# EAGLE design Multi_FPC_BreakOut (EAGLE 5.11)
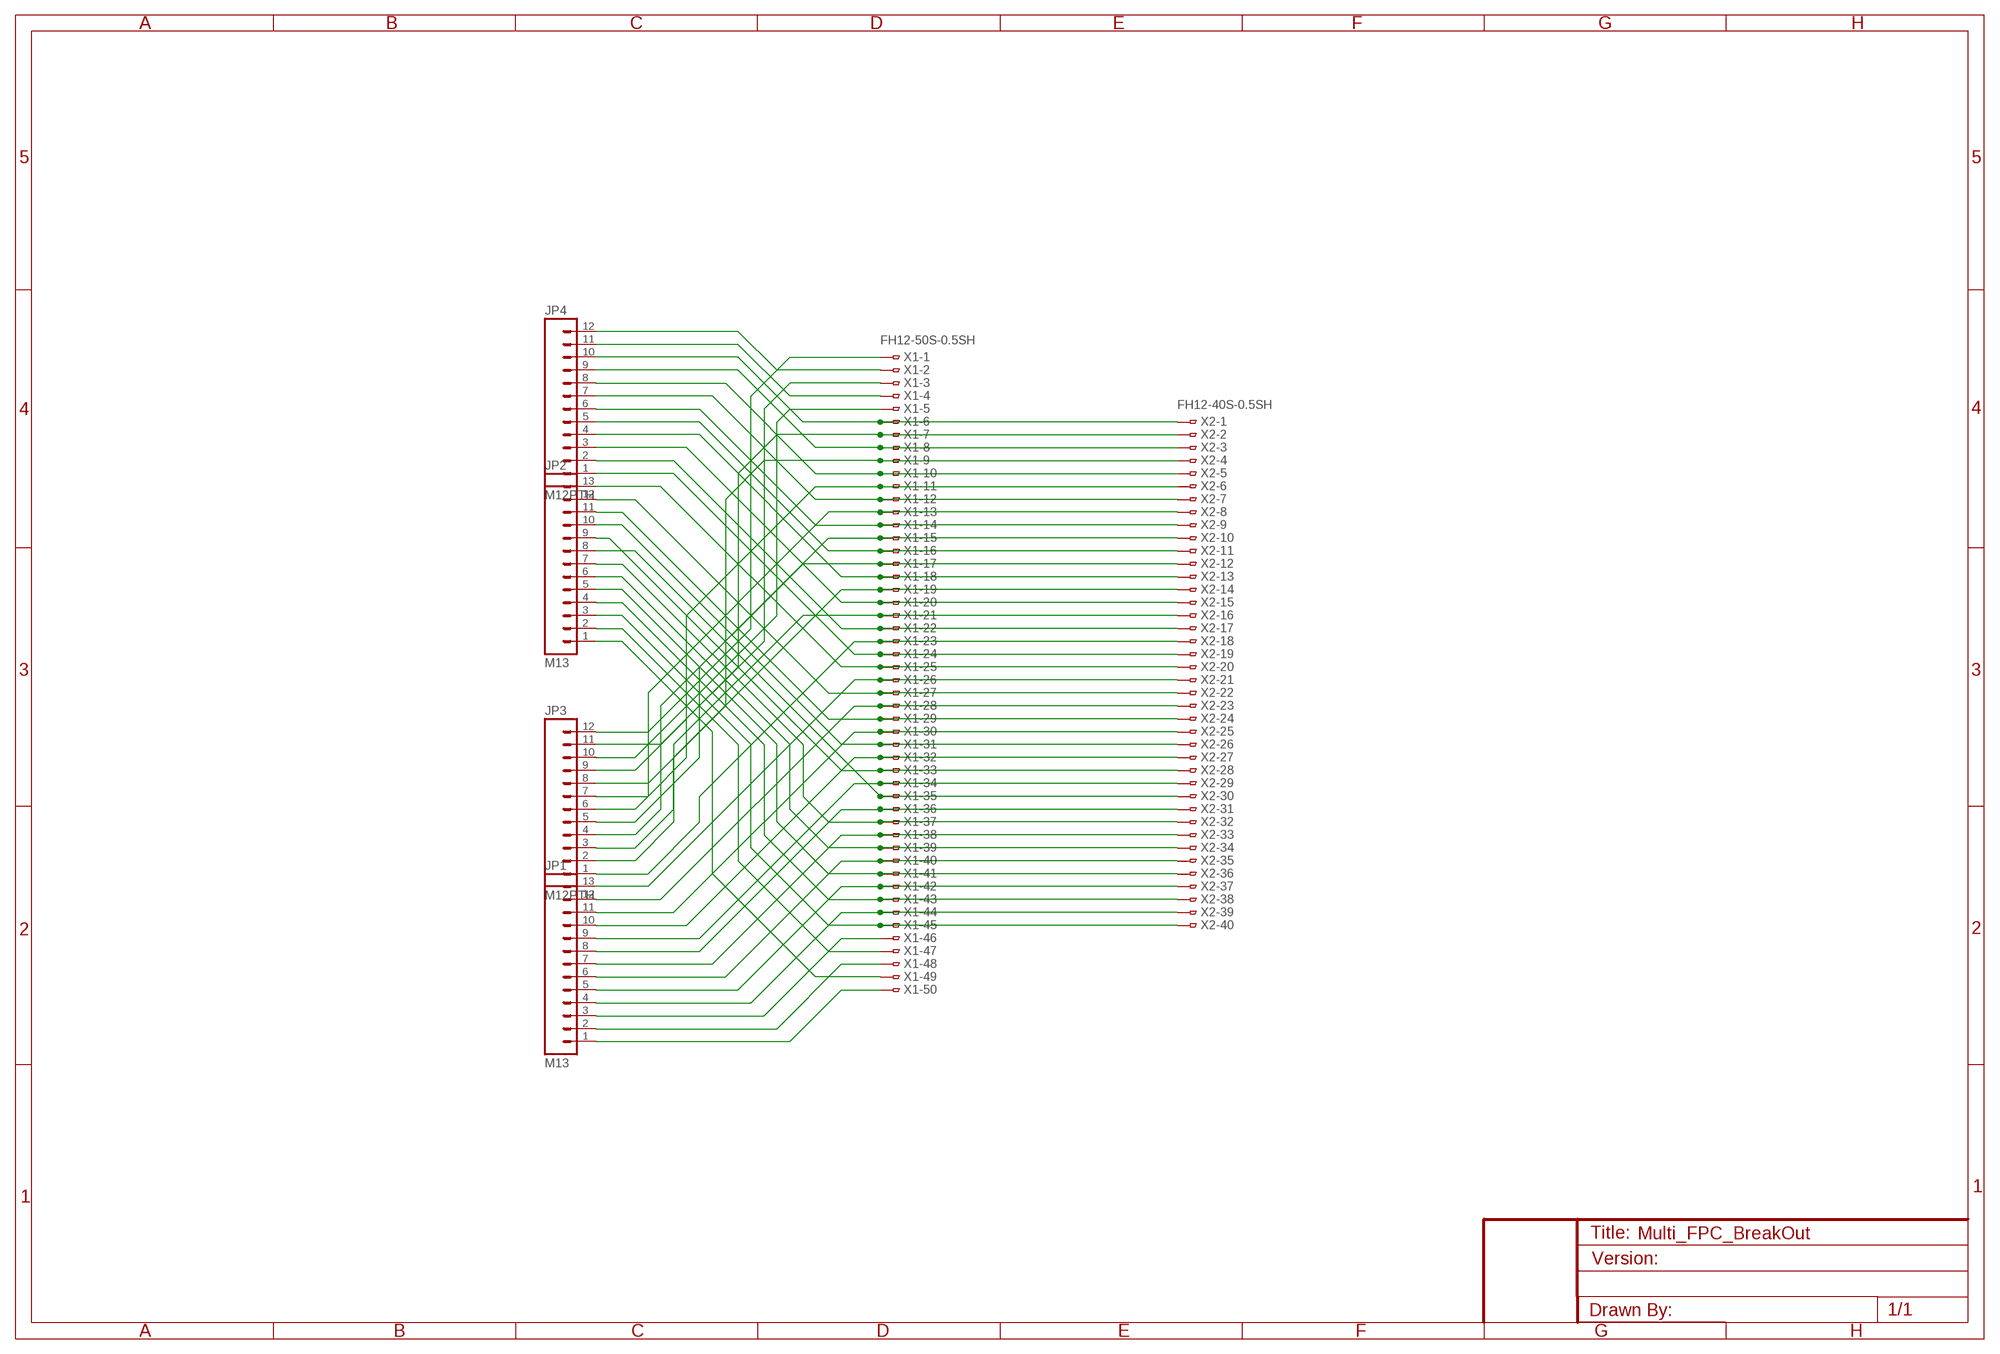
[diagram p0: schematic, sheet 1]

## Parts
JP1  M13  [1X13]
JP2  M13  [1X13]
JP3  M12PTH  [1X12]
JP4  M12PTH  [1X12]
X1  FH12-50S-0.5SH  [FH12-50S-0.5SH]
X2  FH12-40S-0.5SH  [FH12-40S-0.5SH]

## Nets
N$1: JP3.12 X1.1
N$2: JP4.12 X1.2
N$3: JP3.11 X1.3
N$4: JP3.10 X1.5
N$5: JP4.11 X1.4
N$7: JP3.9 X1.7 X2.2
N$9: JP3.8 X1.9 X2.4
N$11: JP3.7 X1.11 X2.6
N$13: JP3.6 X1.13 X2.8
N$15: JP3.5 X1.15 X2.10
N$17: JP3.4 X1.17 X2.12
N$19: JP3.3 X1.19 X2.14
N$20: JP4.3 X1.20 X2.15
N$21: JP3.2 X1.21 X2.16
N$22: JP4.2 X1.22 X2.17
N$23: JP3.1 X1.23 X2.18
N$24: JP4.1 X1.24 X2.19
N$25: JP2.13 X1.25 X2.20
N$26: JP1.13 X1.26 X2.21
N$27: JP2.12 X1.27 X2.22
N$28: JP1.12 X1.28 X2.23
N$29: JP2.11 X1.29 X2.24
N$30: JP1.11 X1.30 X2.25
N$31: JP2.10 X1.31 X2.26
N$32: JP1.10 X1.32 X2.27
N$33: JP2.9 X1.33 X2.28
N$34: JP1.9 X1.34 X2.29
N$35: JP2.8 X1.35 X2.30
N$36: JP1.8 X1.36 X2.31
N$37: JP2.7 X1.37 X2.32
N$38: JP1.7 X1.38 X2.33
N$39: JP2.6 X1.39 X2.34
N$40: JP1.6 X1.40 X2.35
N$41: JP2.5 X1.41 X2.36
N$42: JP1.5 X1.42 X2.37
N$43: JP2.4 X1.43 X2.38
N$44: JP1.4 X1.44 X2.39
N$45: JP2.3 X1.45 X2.40
N$46: JP4.10 X1.6 X2.1
N$47: JP2.2 X1.47
N$48: JP2.1 X1.49
N$50: JP4.9 X1.8 X2.3
N$52: JP4.8 X1.10 X2.5
N$54: JP4.7 X1.12 X2.7
N$56: JP4.6 X1.14 X2.9
N$57: JP1.3 X1.46
N$58: JP1.2 X1.48
N$59: JP1.1 X1.50
N$61: JP4.5 X1.16 X2.11
N$63: JP4.4 X1.18 X2.13

## Library data of the parts
JP1 JP2 = SparkFun:M13
JP3 JP4 = SparkFun:M12: Header 12 Standard 12-pin 0.1" header. Use with straight break away headers (SKU : PRT-00116), right angle break away headers (PRT-00553), swiss pins (PRT-00743), machine pins (PRT-00117), and female headers (PRT-00115).
X1 = con-hirose:FH12-50S-0.5S: 0.5mm Pitch Connectors For FPC/FFC Source: Data sheet <http://www.hirose.co.jp/cataloge_hp/e58605370.pdf>; MPN: FH12-50S-0.5SH(55); OC_FARNELL: 1324557; OC_NEWARK: 34M6181
X2 = con-hirose:FH12-40S-0.5S: 0.5mm Pitch Connectors For FPC/FFC Source: Data sheet <http://www.hirose.co.jp/cataloge_hp/e58605370.pdf>; MPN: FH12-40S-0.5SH(55); OC_FARNELL: 1324556; OC_NEWARK: 34M6178

## Net classes
0 default: width 0.178 mm, drill 0.178 mm, clearance 0.178 mm

## Board
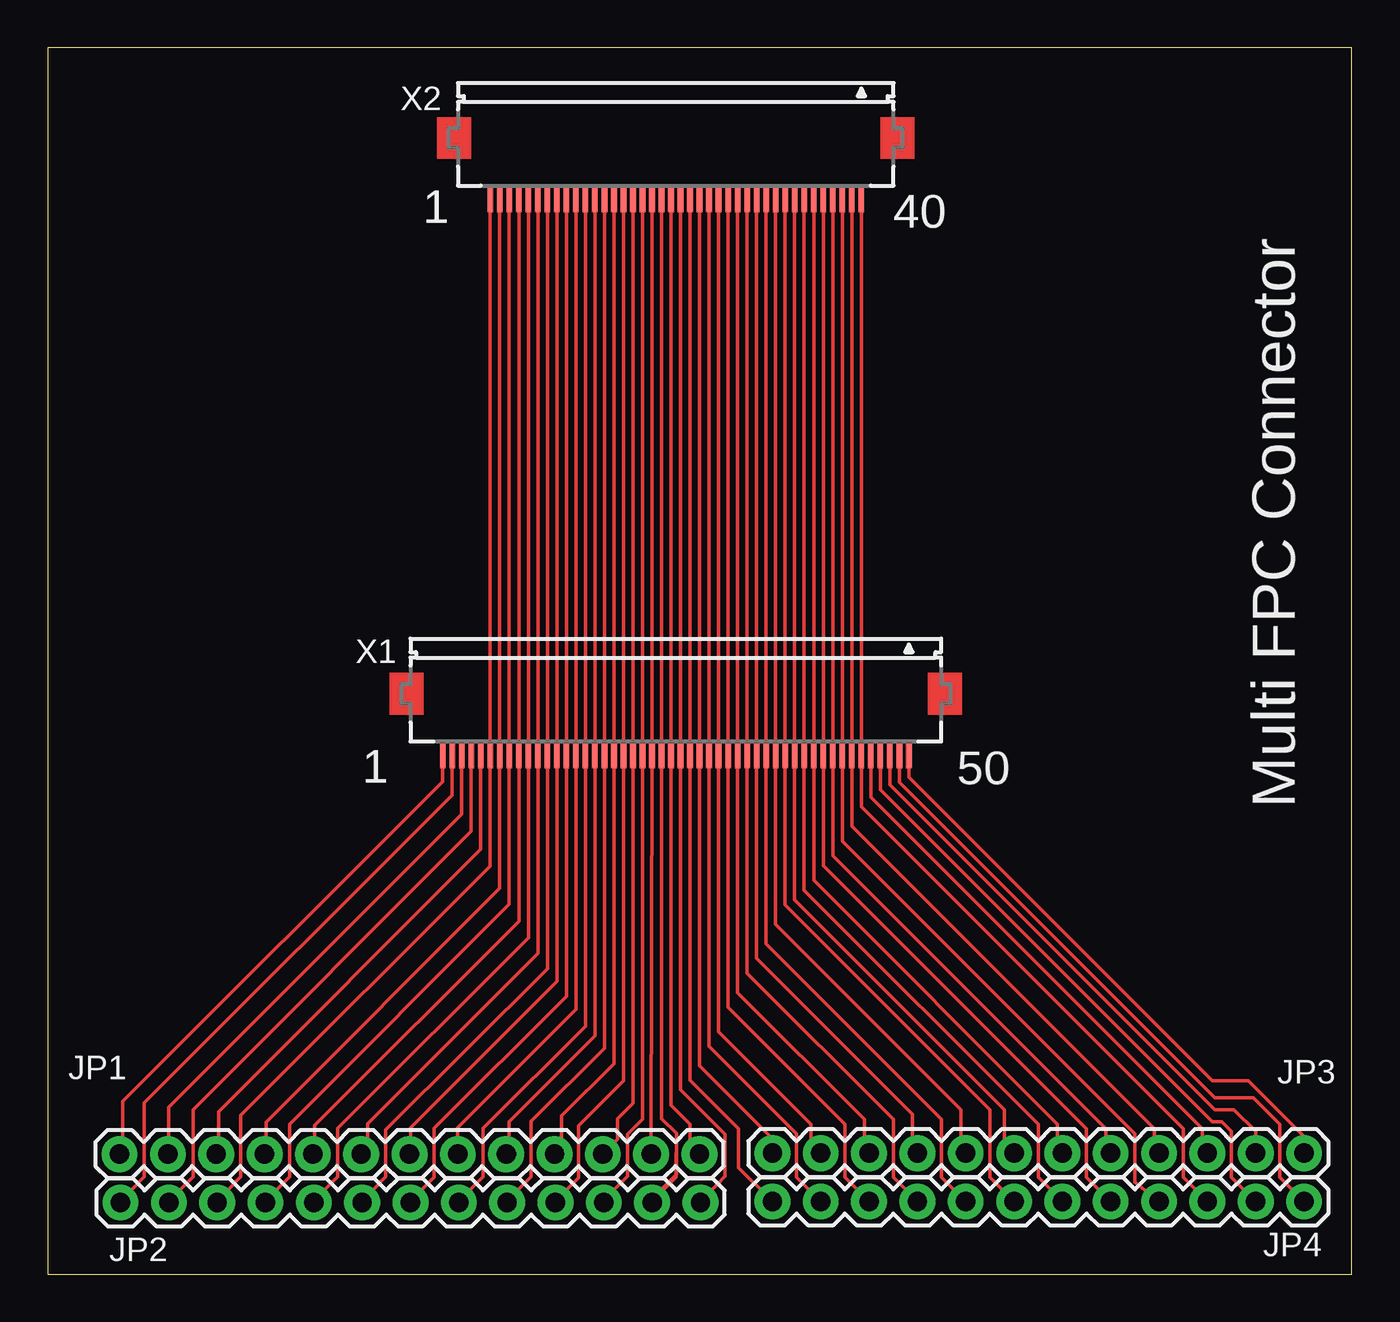
[diagram p1: board, top side]

Size 68.56 x 64.44 mm. Coordinates in mm from the lower left corner, seen from the top.
Outline: 0,0 68.56,0 68.56,64.44 0,64.44 0,0
Copper layers (1*16): Top 0.035mm / dielectric 1.5mm / Bottom 0.035mm
Design rules "PCB-POOL Standard *": minimum track width 7mil, minimum drill 0.3mm, track to track 7mil, track to pad 7mil, pad to pad 7mil, via to via 7mil, smd to smd 7mil, copper to edge 0.3mm, drill to drill 0.2mm, minimum pad ring 0.2mm, minimum via ring 0.15mm, stop-mask expansion 0.075mm, vias tented up to drill 0mil, thermal gap 0.2mm

### Footprints (pad centres in the part's own frame; a part is rotated, then mirrored left to right if it is on the bottom)
1X13 = drill 1.016 pad 1.88 round: 1 0,0; 2 2.54,0; 3 5.08,0; 4 7.62,0; 5 10.16,0; 6 12.7,0; 7 15.24,0; 8 17.78,0; 9 20.32,0; 10 22.86,0; 11 25.4,0; 12 27.94,0; 13 30.48,0
1X12 = drill 1.016 pad 1.88 round: 1 0,0; 2 2.54,0; 3 5.08,0; 4 7.62,0; 5 10.16,0; 6 12.7,0; 7 15.24,0; 8 17.78,0; 9 20.32,0; 10 22.86,0; 11 25.4,0; 12 27.94,0
FH12-50S-0.5SH = smd 0.3 x 1.3: 1 -12.25,3.25; 2 -11.75,3.25; 3 -11.25,3.25; 4 -10.75,3.25; 5 -10.25,3.25; 6 -9.75,3.25; 7 -9.25,3.25; 8 -8.75,3.25; 9 -8.25,3.25; 10 -7.75,3.25; 11 -7.25,3.25; 12 -6.75,3.25; 13 -6.25,3.25; 14 -5.75,3.25; 15 -5.25,3.25; 16 -4.75,3.25; 17 -4.25,3.25; 18 -3.75,3.25; 19 -3.25,3.25; 20 -2.75,3.25; 21 -2.25,3.25; 22 -1.75,3.25; 23 -1.25,3.25; 24 -0.75,3.25; 25 -0.25,3.25; 26 0.25,3.25; 27 0.75,3.25; 28 1.25,3.25; 29 1.75,3.25; 30 2.25,3.25; 31 2.75,3.25; 32 3.25,3.25; 33 3.75,3.25; 34 4.25,3.25; 35 4.75,3.25; 36 5.25,3.25; 37 5.75,3.25; 38 6.25,3.25; 39 6.75,3.25; 40 7.25,3.25; 41 7.75,3.25; 42 8.25,3.25; 43 8.75,3.25; 44 9.25,3.25; 45 9.75,3.25; 46 10.25,3.25; 47 10.75,3.25; 48 11.25,3.25; 49 11.75,3.25; 50 12.25,3.25
FH12-40S-0.5SH = smd 0.3 x 1.3: 1 -9.75,3.25; 2 -9.25,3.25; 3 -8.75,3.25; 4 -8.25,3.25; 5 -7.75,3.25; 6 -7.25,3.25; 7 -6.75,3.25; 8 -6.25,3.25; 9 -5.75,3.25; 10 -5.25,3.25; 11 -4.75,3.25; 12 -4.25,3.25; 13 -3.75,3.25; 14 -3.25,3.25; 15 -2.75,3.25; 16 -2.25,3.25; 17 -1.75,3.25; 18 -1.25,3.25; 19 -0.75,3.25; 20 -0.25,3.25; 21 0.25,3.25; 22 0.75,3.25; 23 1.25,3.25; 24 1.75,3.25; 25 2.25,3.25; 26 2.75,3.25; 27 3.25,3.25; 28 3.75,3.25; 29 4.25,3.25; 30 4.75,3.25; 31 5.25,3.25; 32 5.75,3.25; 33 6.25,3.25; 34 6.75,3.25; 35 7.25,3.25; 36 7.75,3.25; 37 8.25,3.25; 38 8.75,3.25; 39 9.25,3.25; 40 9.75,3.25

### Placement (x,y rotation side)
JP1  3.78,6.3 0 top
JP2  3.84,3.76 0 top
JP3  38.1,6.35 0 top
JP4  38.1,3.81 0 top
X1  33.02,30.48 180 top
X2  33.02,59.69 180 top

### Tracks (layer width: path | path; a pad name or v marks a point on that pad's centre or on a via)
N$1
  Top 0.178: X1.1 45.27,26.1 61.21,10.16 63.12,10.16 66.04,7.24 JP3.12
N$2
  Top 0.178: X1.2 44.77,25.84 61.34,9.27 63.37,9.27 64.77,7.87 64.77,5.08 JP4.12
N$3
  Top 0.178: X1.3 44.27,25.71 61.34,8.64 62.36,8.64 63.5,7.49 JP3.11
N$4
  Top 0.178: X1.5 43.27,25.06 60.71,7.62 60.71,6.6 JP3.10
N$5
  Top 0.178: X1.4 43.77,25.45 61.21,8 61.72,8 62.23,7.49 62.23,5.08 JP4.11
N$7
  Top 0.178: JP3.9 58.17,6.6 58.17,7.62 42.27,23.52 X1.7 X2.2
N$9
  Top 0.178: JP3.8 55.63,6.6 55.63,7.62 41.27,21.98 X1.9 X2.4
N$11
  Top 0.178: JP3.7 53.09,6.6 53.09,7.87 40.27,20.69 X1.11 X2.6
N$13
  Top 0.178: JP3.6 50.29,6.86 50.29,8.64 39.27,19.66 X1.13 X2.8
N$15
  Top 0.178: JP3.5 48.01,6.6 48.01,8.64 38.27,18.37 X1.15 X2.10
N$17
  Top 0.178: JP3.4 45.47,6.6 45.47,8.38 37.27,16.58 X1.17 X2.12
N$19
  Top 0.178: JP3.3 42.93,6.6 42.93,8.13 36.27,14.78 X1.19 X2.14
N$20
  Top 0.178: JP4.3 41.91,5.08 41.91,7.87 35.77,14.01 X1.20 X2.15
N$21
  Top 0.178: JP3.2 40.13,6.86 40.13,7.87 35.27,12.74 X1.21 X2.16
N$22
  Top 0.178: JP4.2 39.37,5.08 39.37,7.37 34.77,11.97 X1.22 X2.17
N$23
  Top 0.178: JP3.1 38.1,7.11 34.27,10.94 X1.23 X2.18
N$24
  Top 0.178: JP4.1 36.32,5.59 36.32,7.62 33.77,10.17 X1.24 X2.19
N$25
  Top 0.178: JP2.13 35.61,5.13 35.61,7.34 33.27,9.68 X1.25 X2.20
N$26
  Top 0.178: JP1.13 33.76,6.88 33.76,7.87 32.77,8.86 X1.26 X2.21
N$27
  Top 0.178: 33.05,6.35 33.05,5.23 31.75,3.94 | 33.05,6.35 33.05,7.39 32.27,8.17 X1.27 32.26,29.34 X2.22 | JP2.12 31.75,3.81 33.02,5.08 33.02,6.35 33.05,6.35
N$28
  Top 0.178: X1.28 31.75,27.21 | X1.28 JP1.12 | X1.28 X2.23
N$29
  Top 0.178: JP2.11 29.23,3.89 30.48,5.13 30.48,7.34 31.27,8.13 X1.29 X2.24
N$30
  Top 0.178: JP1.11 29.18,6.33 29.95,7.09 29.95,8.15 30.77,8.98 X1.30 X2.25
N$31
  Top 0.178: JP2.10 26.7,3.83 27.91,5.05 27.91,7.8 30.27,10.15 X1.31 X2.26
N$32
  Top 0.178: JP1.10 27.03,6.71 27.03,8.31 29.77,11.05 X1.32 X2.27
N$33
  Top 0.178: JP2.9 24.16,3.83 25.43,5.11 25.43,8.03 29.27,11.87 X1.33 X2.28
N$34
  Top 0.178: X2.29 X1.34 28.77,12.51 24.26,8 24.26,6.48 JP1.9
N$35
  Top 0.178: JP2.8 21.61,3.83 22.89,5.11 22.89,7.64 28.27,13.03 X1.35 X2.30
N$36
  Top 0.178: JP1.8 21.57,7.7 27.77,13.9 X1.36 X2.31
N$37
  Top 0.178: JP2.7 19.07,3.83 20.32,5.08 20.32,7.64 27.27,14.6 X1.37 X2.32
N$38
  Top 0.178: JP1.7 19.07,6.38 19.07,7.7 26.77,15.39 X1.38 X2.33
N$39
  Top 0.178: JP2.6 16.54,3.83 17.78,5.11 17.78,7.57 26.27,16.03 X1.39 X2.34
N$40
  Top 0.178: JP1.6 16.82,6.66 16.82,7.9 25.77,16.86 X1.40 X2.35
N$41
  Top 0.178: JP2.5 13.99,3.83 15.24,5.11 15.24,7.67 25.27,17.68 X1.41 X2.36
N$42
  Top 0.178: X2.37 X1.42 24.77,18.55 14.05,7.82 14.05,6.43 JP1.5
N$43
  Top 0.178: JP2.4 11.46,3.83 12.72,5.11 12.72,7.87 24.27,19.42 X1.43 X2.38
N$44
  Top 0.178: JP1.4 11.48,6.4 11.48,7.98 23.77,20.27 X1.44 X2.39
N$45
  Top 0.178: JP2.3 8.91,3.83 10.16,5.11 10.16,8.33 23.27,21.42 X1.45 X2.40
N$46
  Top 0.178: JP4.10 59.69,5.08 59.69,7.62 42.77,24.54 X1.6 X2.1
N$47
  Top 0.178: X1.47 22.27,23.26 7.64,8.64 7.64,5.11 6.38,3.83 JP2.2
N$48
  Top 0.178: X1.49 21.27,25.16 5.08,8.99 5.08,5.11 3.83,3.83 JP2.1
N$50
  Top 0.178: JP4.9 57.15,4.83 57.15,7.37 41.77,22.75 X1.8 X2.3
N$52
  Top 0.178: JP4.8 54.61,5.08 54.61,7.62 40.77,21.46 X1.10 X2.5
N$54
  Top 0.178: JP4.7 52.07,5.08 52.07,7.87 39.77,20.17 X1.12 X2.7
N$56
  Top 0.178: JP4.6 49.53,5.08 49.53,8.64 38.77,19.4 X1.14 X2.9
N$57
  Top 0.178: X1.46 22.77,22.31 8.99,8.53 8.99,6.45 JP1.3
N$58
  Top 0.178: X1.48 21.77,24.16 6.38,8.76 6.38,6.38 6.35,6.35 JP1.2
N$59
  Top 0.178: X1.50 20.77,25.88 3.96,9.07 3.95,6.41 JP1.1
N$61
  Top 0.178: JP4.5 46.99,5.08 46.99,8.13 37.77,17.35 X1.16 X2.11
N$63
  Top 0.178: JP4.4 44.45,5.08 44.45,8.13 36.77,15.81 X1.18 X2.13

### Text on the board
tPlace: 1 | 40 | 1 | 50 | Multi FPC Connector